# Altium schematic sheet BMU_V50_CAN.SchDoc
size C
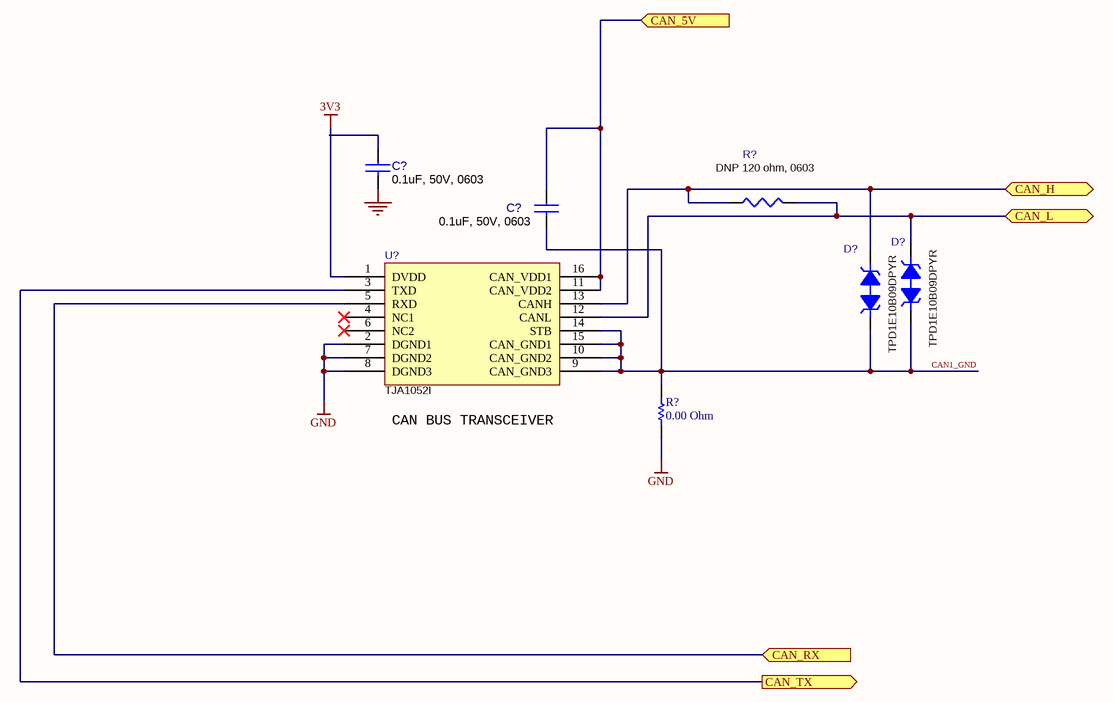
[diagram p0: BMU_V50_CAN.SchDoc]

## Parts
(Parts that share a designator on the sheet are numbered #1, #2 ... from top to bottom, then left to right.)
C?#1  0.1uF, 50V, 0603  [C0603]
C?#2  0.1uF, 50V, 0603  [C0603]
D?#1  TPD1E10B09DPYR  [2X2SON]
D?#2  TPD1E10B09DPYR  [2X2SON]
R?#1  DNP 120 ohm, 0603  [R0603]  (no BOM)
R?#2  value 0.00 Ohm  [RESC0402(1005)_L]  (hidden comment: Jumper 0402(1005))
U?  TJA1052I  [16-SOIC]

## Ports
CAN_5V (in), CAN_H (bidir), CAN_L (bidir), CAN_RX (in), CAN_TX (out)

## Nets
3V3: U?.1(DVDD)
GND: C?#1.2 R?#2.2 U?.2(DGND1) U?.7(DGND2) U?.8(DGND3)
CAN1_GND: C?#2.2 D?#1.1 D?#2.1 R?#2.1 U?.9(CAN_GND3) U?.10(CAN_GND2) U?.14(STB) U?.15(CAN_GND1)
CAN_5V: C?#2.1 U?.11(CAN_VDD2) U?.16(CAN_VDD1) ; port CAN_5V
CAN_H: D?#2.2 R?#1.1 U?.13(CANH) ; port CAN_H
CAN_L: D?#1.2 R?#1.2 U?.12(CANL) ; port CAN_L
CAN_RX: U?.5(RXD) ; port CAN_RX
CAN_TX: U?.3(TXD) ; port CAN_TX

Not connected (* = marked no-connect by the designer): C?#1 1; U? 4(NC1)* 6(NC2)*

## Notes on the sheet
- (near R?#2) CAN BUS TRANSCEIVER
- Title
- MATTERNET
- PROPRIETRY & CONFIDENTIAL
  THE INFORMATION CONTAINS IN THIS DRAWING
  IS THE SOLE PROPERTY OF  MATTERNET Inc.
  ANY REPRODUCTION IN PART OR AS WHOLE
  WITHOUT A WRITTEN PERMISSION OF
  MATTERNET Inc. IS PROHIBITED
- Size:
- Date:
- File:
- C
- Number:
- Time:
- Revision:
- Sheet
- of
- 161 E. Evelyn Ave.
- Mountain View,
- CA 94041 USA

## Library data of the parts
C?#1 C?#2 = CAP-Generic-0603: CAP CER 0.1UF 50V 10% X7R 0603; Manufacturer: Murata; Manufacturer Part Number: GCJ188R71E104KA12D; Supplier 1: Digi-Key; Supplier Part Number 1: 490-16477-1-ND; Stock 1: 2560; Pricing 1: 1=0.22, 10=0.152, 100=0.077, 500=0.0527, 1000=0.04662 (USD); Case/Package: 0603; Supplier 2: Mouser; Supplier Part Number 2: 81-GCJ188R71E104KA2D; Stock 2: 47905; Pricing 2: 1=0.21, 10=0.139, 50=0.139, 100=0.071, 1000=0.043, 10000=0.035 (USD)
D?#1 D?#2 = ESD BI-DIR TRIG 9VDC 0402_0: TVS DIODE 9VWM 20VC 2X2SON; Manufacturer: Texas Instruments; custinv: Ansync; custprt: 100-0500-000170; Option: AB; Direction: Bidirectional; Capacitance: 10pF; Number of Channels: 1; Reverse Standoff Voltage: 9V; Clamping Voltage: 20V; Peak Pulse Power: 90W; Power Line Protection: No; Breakdown Voltage: 9.5V; Leakage Current: 100nA; ESD Protection: Yes; Test Current: 1mA; Element Configuration: Single; Peak Pulse Current: 4.5A; TYPE: Diode; Supplier 1: Digi-Key; Supplier Part Number 1: 296-30405-1-ND; Manufacturer Part Number: TPD1E10B09DPYR; Stock 1: 89820; Pricing 1: 1=0.45, 10=0.336, 100=0.2096, 500=0.1434, 1000=0.11031 (USD); Case/Package: 0402; Number of Pins: 2; Contact Plating: Gold; Min Operating Temperature: -40°C; Max Operating Temperature: 125°C; Packaging: Tape and Reel; Package Quantity: 1; Number of Bidirectional Channels: 1; Min Breakdown Voltage: 9V; Working Voltage: 9V; Max Reverse Leakage Current: 100nA; Operating Supply Voltage: 9V; Composition: Zener; Length: 1.1mm; Height: 0.4mm; Width: 0.7mm; Radiation Hardening: No; REACH SVHC: No SVHC; Lead Free: Lead Free; ComponentLink1URL: http://www.ti.com/general/docs/lit/getliterature.tsp?genericPartNumber=TPD1E10B09&&fileType=pdf; ComponentLink1Description: http://www.ti.com/general/docs/lit/getliterature.tsp?genericPartNumber=TPD1E10B09&&fileType=pdf; ComponentLink2URL: http://www.ti.com/lit/ds/sllseb0b/sllseb0b.pdf; ComponentLink2Description: http://www.ti.com/lit/ds/sllseb0b/sllseb0b.pdf; ComponentLink3URL: http://www.ti.com/lit/ds/symlink/tpd1e10b09.pdf; ComponentLink3Description: http://www.ti.com/lit/ds/symlink/tpd1e10b09.pdf
R?#1 = R-Generic-0603: custprt: 100-0100-000119; custinv: Ansync; Option: C
R?#2 = CMP-1011-00001-1: Jumper 0402 (1005 Metric); Tolerance: None; Case-Metric: 1005; Case-EIA: 0402; Power: None; Technology: SMT
U? = TJA1052I: CAN Bus, Transceiver SOIC; Manufacturer: NXP Semiconductors; Manufacturer Part Number: TJA1052IT/5Y; Max Supply Voltage: 5.25V; Number of Transmit Buffers: 1; Min Supply Voltage: 3V; Data Rate: 5Mbps; Number of Channels: 2; Channel Type: Unidirectional; Isolated Power: No; Supplier 1: Digi-Key; Supplier Part Number 1: 568-11942-1-ND; Stock 1: 1928; Pricing 1: 1=5.27, 10=4.732, 100=3.8768, 500=3.30026 (USD); Case/Package: SOIC; Number of Pins: 16; Min Operating Temperature: -40°C; Max Operating Temperature: 125°C; Number of Receive Buffers: 1; Packaging: Cut Tape; Interface: CAN; Number of Transceivers: 1; Radiation Hardening: No; REACH SVHC: No SVHC; ComponentLink1URL: http://www.farnell.com/datasheets/2045698.pdf; ComponentLink1Description: http://www.farnell.com/datasheets/2045698.pdf; ComponentLink2URL: http://www.nxp.com/documents/data_sheet/TJA1052I.pdf; ComponentLink2Description: http://www.nxp.com/documents/data_sheet/TJA1052I.pdf